# EAGLE design blockoccdelay (EAGLE 9.4.2)
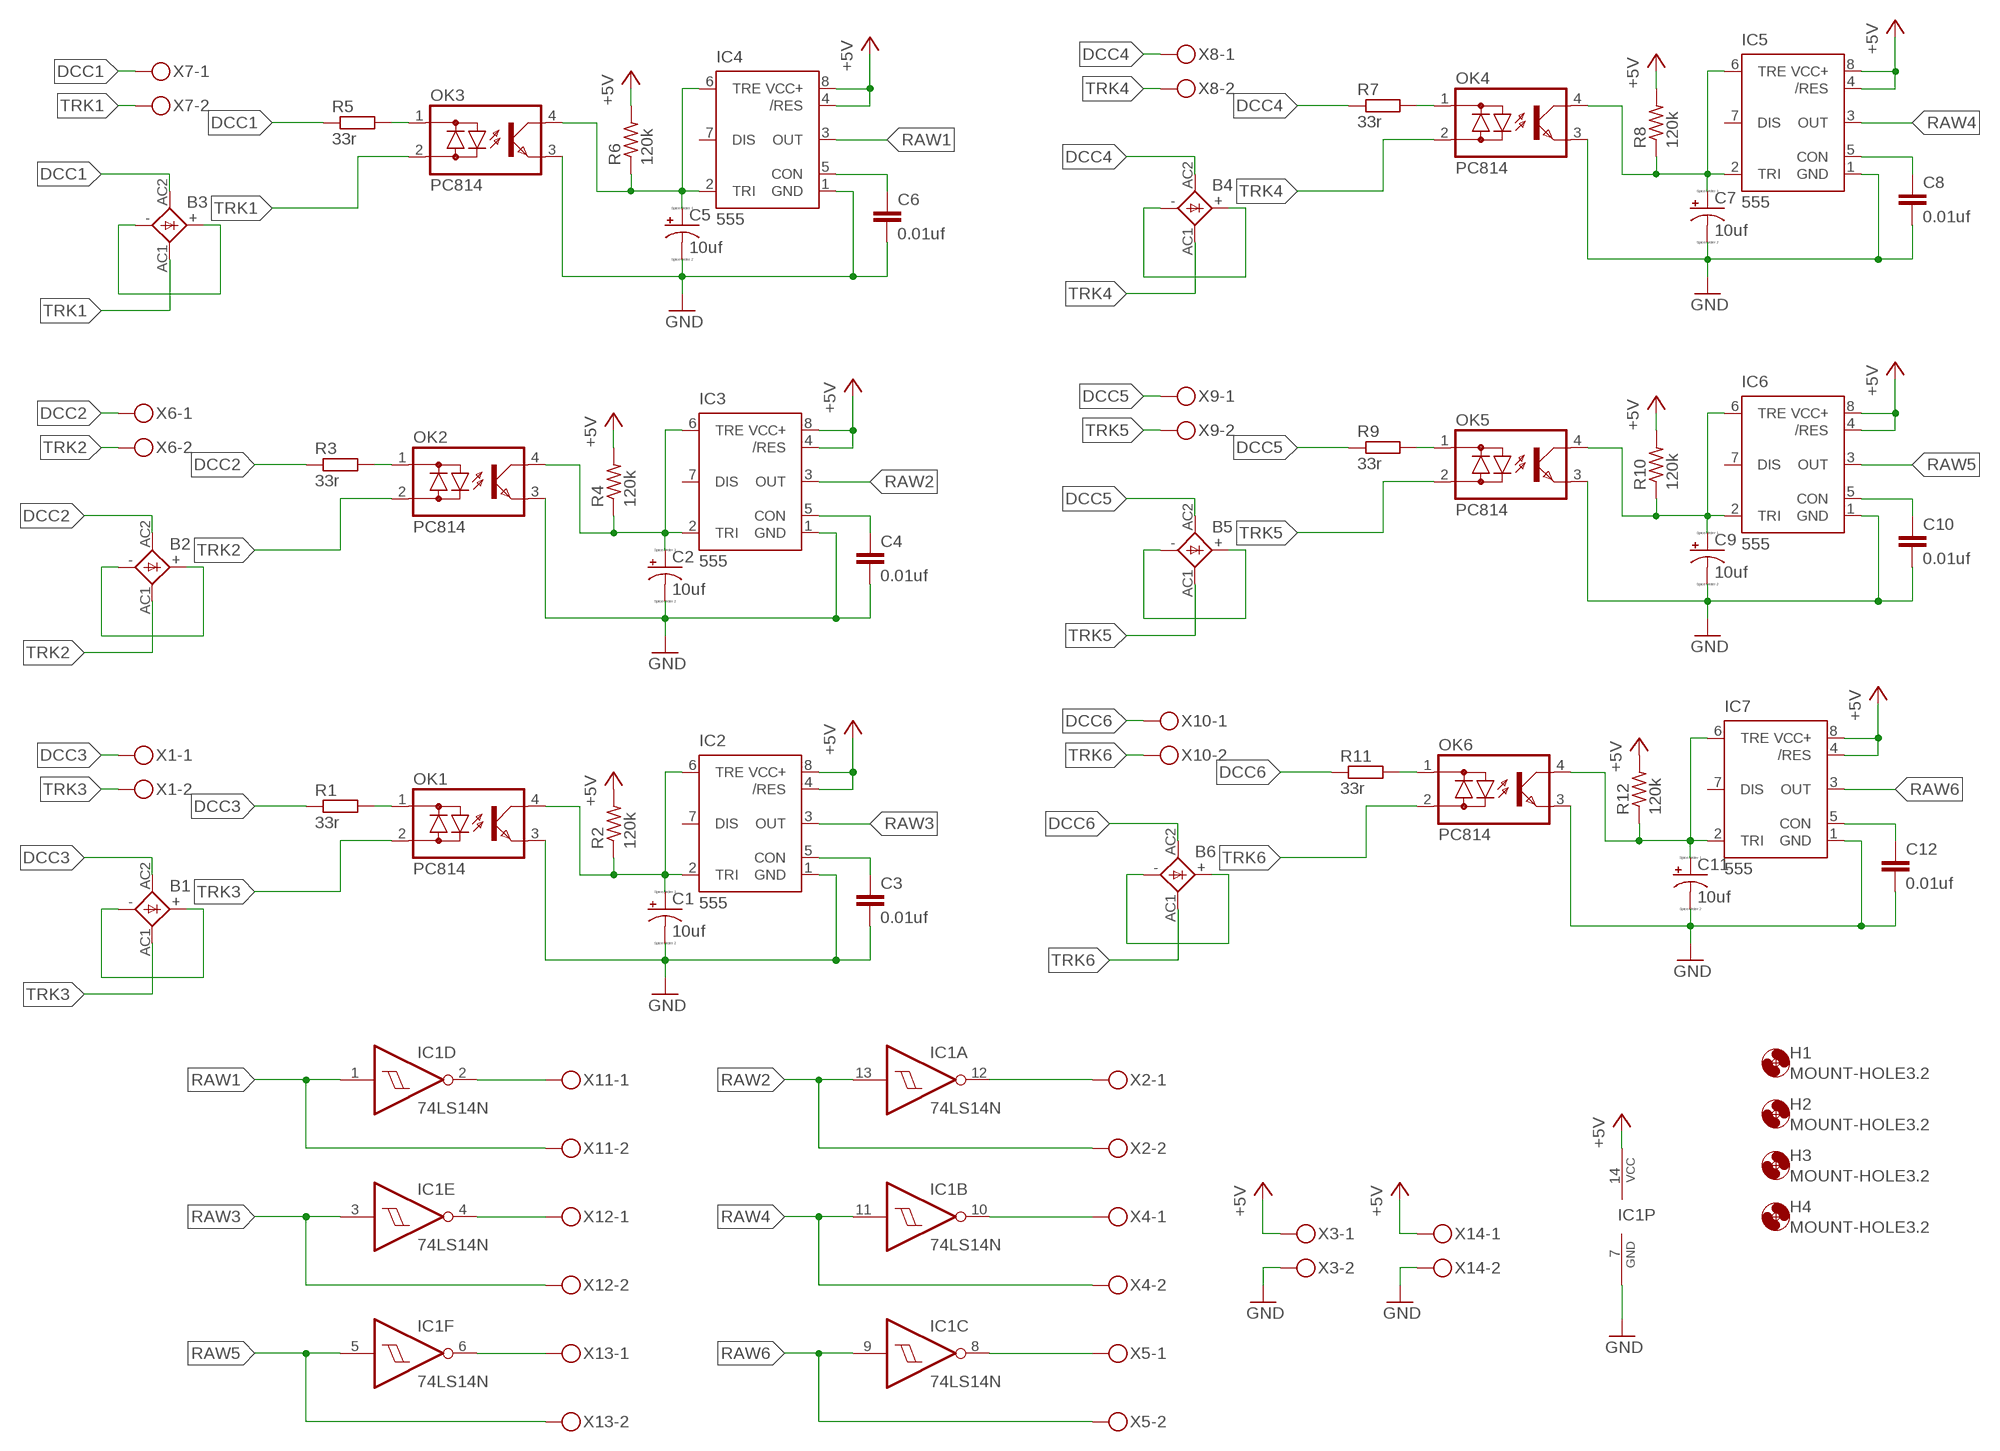
[diagram p0: schematic, sheet 1]

## Parts
B1  GBU4  [GBU4S]
B2  GBU4  [GBU4S]
B3  GBU4  [GBU4S]
B4  GBU4  [GBU4S]
B5  GBU4  [GBU4S]
B6  GBU4  [GBU4S]
C1  10uf  CPOL-USE2.5-6  [E2,5-6]
C2  10uf  CPOL-USE2.5-6  [E2,5-6]
C3  0.01uf  C-EU050-035X075  [C050-035X075]
C4  0.01uf  C-EU050-035X075  [C050-035X075]
C5  10uf  CPOL-USE2.5-6  [E2,5-6]
C6  0.01uf  C-EU050-035X075  [C050-035X075]
C7  10uf  CPOL-USE2.5-6  [E2,5-6]
C8  0.01uf  C-EU050-035X075  [C050-035X075]
C9  10uf  CPOL-USE2.5-6  [E2,5-6]
C10  0.01uf  C-EU050-035X075  [C050-035X075]
C11  10uf  CPOL-USE2.5-6  [E2,5-6]
C12  0.01uf  C-EU050-035X075  [C050-035X075]
H1  MOUNT-HOLE3.2  [3,2]
H2  MOUNT-HOLE3.2  [3,2]
H3  MOUNT-HOLE3.2  [3,2]
H4  MOUNT-HOLE3.2  [3,2]
IC1  74LS14N  [DIL14]
IC2  555  555P  [DIP08]
IC3  555  555P  [DIP08]
IC4  555  555P  [DIP08]
IC5  555  555P  [DIP08]
IC6  555  555P  [DIP08]
IC7  555  555P  [DIP08]
OK1  PC814  [DIL04]
OK2  PC814  [DIL04]
OK3  PC814  [DIL04]
OK4  PC814  [DIL04]
OK5  PC814  [DIL04]
OK6  PC814  [DIL04]
R1  33r  R-EU_0207/2V  [0207/2V]
R2  120k  R-US_0309/V  [0309V]
R3  33r  R-EU_0207/2V  [0207/2V]
R4  120k  R-US_0309/V  [0309V]
R5  33r  R-EU_0207/2V  [0207/2V]
R6  120k  R-US_0309/V  [0309V]
R7  33r  R-EU_0207/2V  [0207/2V]
R8  120k  R-US_0309/V  [0309V]
R9  33r  R-EU_0207/2V  [0207/2V]
R10  120k  R-US_0309/V  [0309V]
R11  33r  R-EU_0207/2V  [0207/2V]
R12  120k  R-US_0309/V  [0309V]
X1  MKDSN1,5/2-5,08  [MKDSN1,5/2-5,08]
X2  MKDSN1,5/2-5,08  [MKDSN1,5/2-5,08]
X3  MKDSN1,5/2-5,08  [MKDSN1,5/2-5,08]
X4  MKDSN1,5/2-5,08  [MKDSN1,5/2-5,08]
X5  MKDSN1,5/2-5,08  [MKDSN1,5/2-5,08]
X6  MKDSN1,5/2-5,08  [MKDSN1,5/2-5,08]
X7  MKDSN1,5/2-5,08  [MKDSN1,5/2-5,08]
X8  MKDSN1,5/2-5,08  [MKDSN1,5/2-5,08]
X9  MKDSN1,5/2-5,08  [MKDSN1,5/2-5,08]
X10  MKDSN1,5/2-5,08  [MKDSN1,5/2-5,08]
X11  MKDSN1,5/2-5,08  [MKDSN1,5/2-5,08]
X12  MKDSN1,5/2-5,08  [MKDSN1,5/2-5,08]
X13  MKDSN1,5/2-5,08  [MKDSN1,5/2-5,08]
X14  MKDSN1,5/2-5,08  [MKDSN1,5/2-5,08]

## Nets
+5V: IC1.14(P:VCC) IC2.4(/RES) IC2.8(VCC+) IC3.4(/RES) IC3.8(VCC+) IC4.4(/RES) IC4.8(VCC+) IC5.4(/RES) IC5.8(VCC+) IC6.4(/RES) IC6.8(VCC+) IC7.4(/RES) IC7.8(VCC+) R2.2 R4.2 R6.2 R8.2 R10.2 R12.2 X3.1 X14.1
DCC1: B3.AC2(AC1) R5.1 X7.1
DCC2: B2.AC2(AC1) R3.1 X6.1
DCC3: B1.AC2(AC1) R1.1 X1.1
DCC4: B4.AC2(AC1) R7.1 X8.1
DCC5: B5.AC2(AC1) R9.1 X9.1
DCC6: B6.AC2(AC1) R11.1 X10.1
GND: C1.- C2.- C3.2 C4.2 C5.- C6.2 C7.- C8.2 C9.- C10.2 C11.- C12.2 IC1.7(P:GND) IC2.1(GND) IC3.1(GND) IC4.1(GND) IC5.1(GND) IC6.1(GND) IC7.1(GND) OK1.3(E) OK2.3(E) OK3.3(E) OK4.3(E) OK5.3(E) OK6.3(E) X3.2 X14.2
N$1: B1.+ B1.-
N$2: OK1.1(AC1) R1.2
N$3: C3.1 IC2.5(CON)
N$4: IC1.12(A:O) X2.1
N$5: B4.+ B4.-
N$6: OK4.1(AC1) R7.2
N$7: IC1.10(B:O) X4.1
N$8: C8.1 IC5.5(CON)
N$9: IC1.8(C:O) X5.1
N$10: B2.+ B2.-
N$11: OK2.1(AC1) R3.2
N$12: C4.1 IC3.5(CON)
N$13: B3.+ B3.-
N$14: OK3.1(AC1) R5.2
N$15: C6.1 IC4.5(CON)
N$16: B5.+ B5.-
N$17: OK5.1(AC1) R9.2
N$18: C10.1 IC6.5(CON)
N$19: B6.+ B6.-
N$20: OK6.1(AC1) R11.2
N$21: C12.1 IC7.5(CON)
N$22: IC1.2(D:O) X11.1
N$23: IC1.4(E:O) X12.1
N$24: IC1.6(F:O) X13.1
RAW1: IC1.1(D:I) IC4.3(OUT) X11.2
RAW2: IC1.13(A:I) IC3.3(OUT) X2.2
RAW3: IC1.3(E:I) IC2.3(OUT) X12.2
RAW4: IC1.11(B:I) IC5.3(OUT) X4.2
RAW5: IC1.5(F:I) IC6.3(OUT) X13.2
RAW6: IC1.9(C:I) IC7.3(OUT) X5.2
TRI: C1.+ IC2.2(TRI) IC2.6(TRE) OK1.4(C) R2.1
TRI1: C2.+ IC3.2(TRI) IC3.6(TRE) OK2.4(C) R4.1
TRI2: C5.+ IC4.2(TRI) IC4.6(TRE) OK3.4(C) R6.1
TRI3: C7.+ IC5.2(TRI) IC5.6(TRE) OK4.4(C) R8.1
TRI4: C9.+ IC6.2(TRI) IC6.6(TRE) OK5.4(C) R10.1
TRI5: C11.+ IC7.2(TRI) IC7.6(TRE) OK6.4(C) R12.1
TRK1: B3.AC1(AC2) OK3.2(AC2) X7.2
TRK2: B2.AC1(AC2) OK2.2(AC2) X6.2
TRK3: B1.AC1(AC2) OK1.2(AC2) X1.2
TRK4: B4.AC1(AC2) OK4.2(AC2) X8.2
TRK5: B5.AC1(AC2) OK5.2(AC2) X9.2
TRK6: B6.AC1(AC2) OK6.2(AC2) X10.2
Unconnected: IC2.7(DIS) IC3.7(DIS) IC4.7(DIS) IC5.7(DIS) IC6.7(DIS) IC7.7(DIS)

## Library data of the parts
B1-B6 = rectifier:GBU4: GENERAL INSTRUMENT RECTIFIER
C1 C2 C5 C7 C9 C11 = resistor:CPOL-US: POLARIZED CAPACITOR, American symbol
C3 C4 C6 C8 C10 C12 = resistor:C-EU: CAPACITOR, European symbol
H1-H4 = holes:MOUNT-HOLE: MOUNTING HOLE with drill center marker
IC1 = 74xx-us:74*14: Hex schmitt trigger INVERTER
IC2-IC7 = SparkFun-IC-Special-Function:555: General purpose bipolar Timer Datasheet <http://www.sparkfun.com/datasheets/Components/General/ne555.pdf> SparkFun Products SparkFun SparkPunk Sequencer Kit <https://www.sparkfun.com/products/12707> (KIT-12707) Storefront Component: 555 Timer <https://www.sparkfun.com/products/9273> (COM-09273) Two parts valid for production: VFP: IC-11930 (M7555 PTH) VFP: IC-09173 (555 PTH) - Preferred; PROD_ID: IC-09173; PROD_ID_ALT: IC-09173
OK1-OK6 = optocoupler:PC814: SHARP OPTO COUPLER; OC_FARNELL: 9707662; OC_NEWARK: unknown
R1 R3 R5 R7 R9 R11 = resistor:R-EU_: RESISTOR, European symbol
R2 R4 R6 R8 R10 R12 = resistor:R-US_: RESISTOR, American symbol
X1-X14 = con-phoenix-508:MKDSN1,5/2-5,08: MKDSN 1,5/ 2-5,08 Printklemme Nennstrom: 13,5 A Nennspannung: 250 V Rastermaß: 5,08 mm Polzahl: 2 Anschlussart: Schraubanschluss Montage: Löten Anschlussrichtung Leiter/Platine: 0 ° Artikelnummer: 1729128 Source: http://eshop.phoenixcontact.com .. 1729128.pdf

## Board
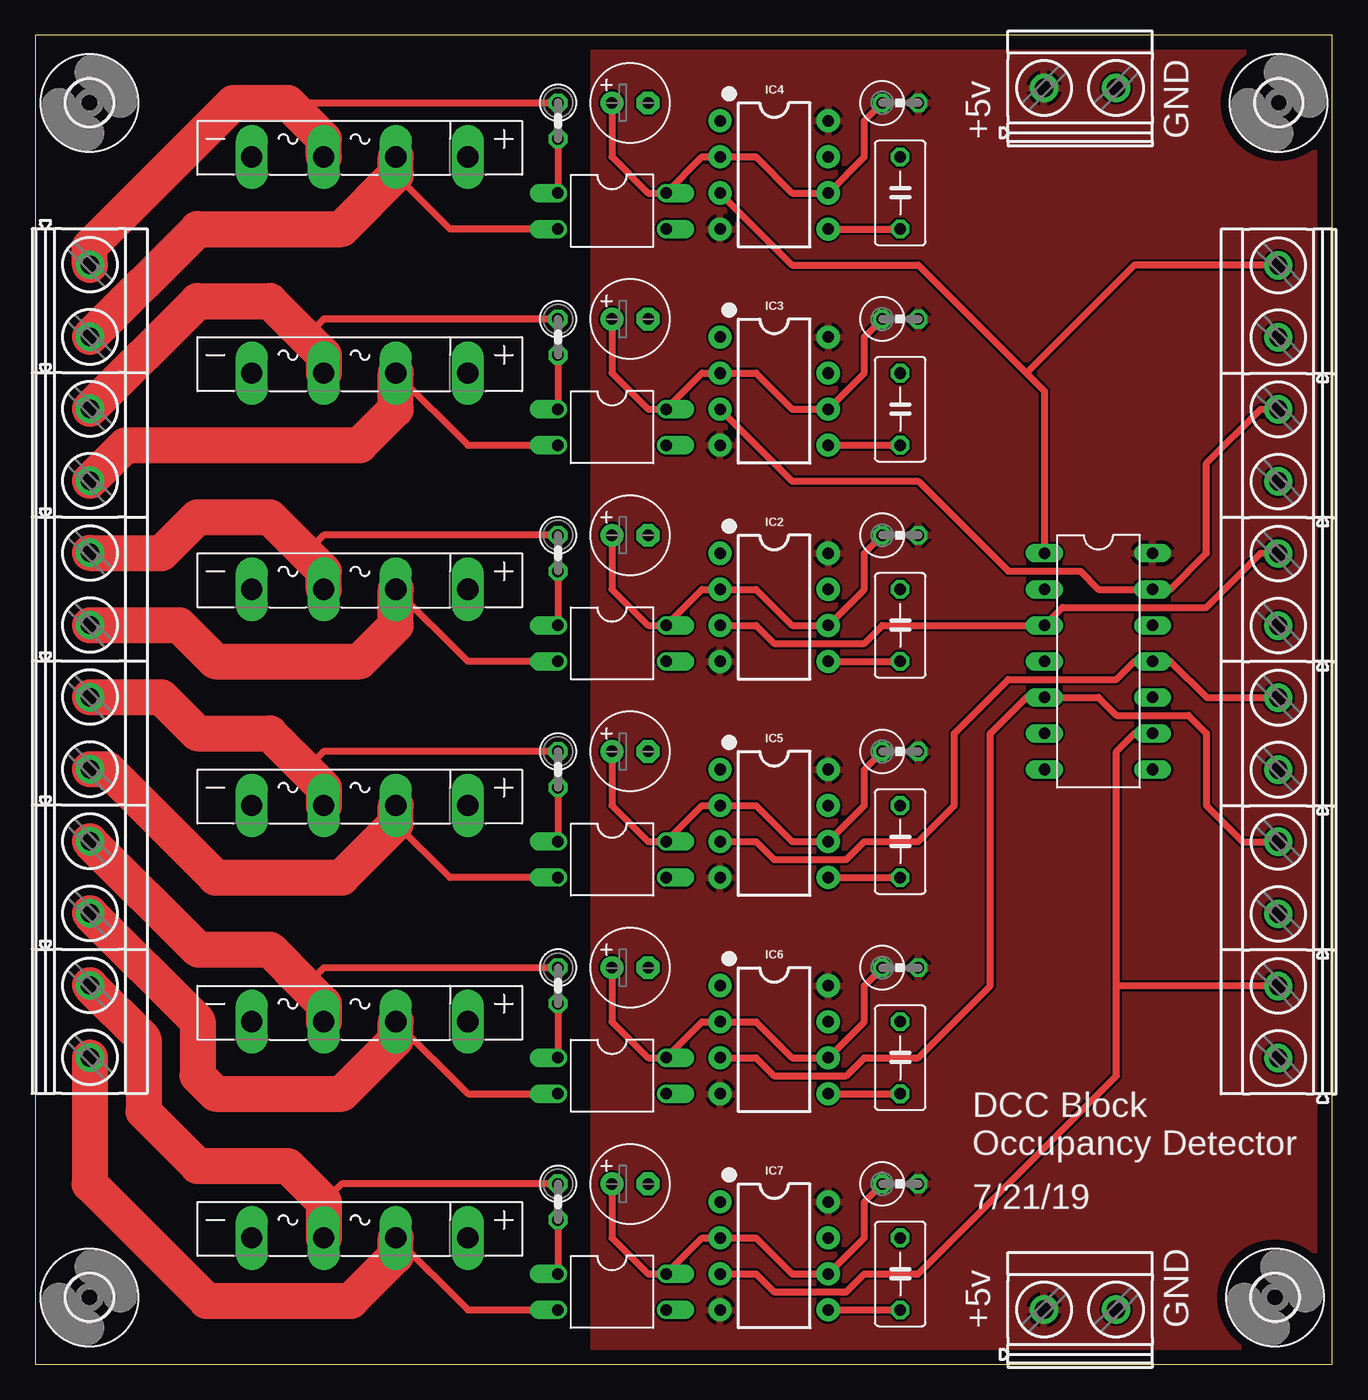
[diagram p1: board, top side]
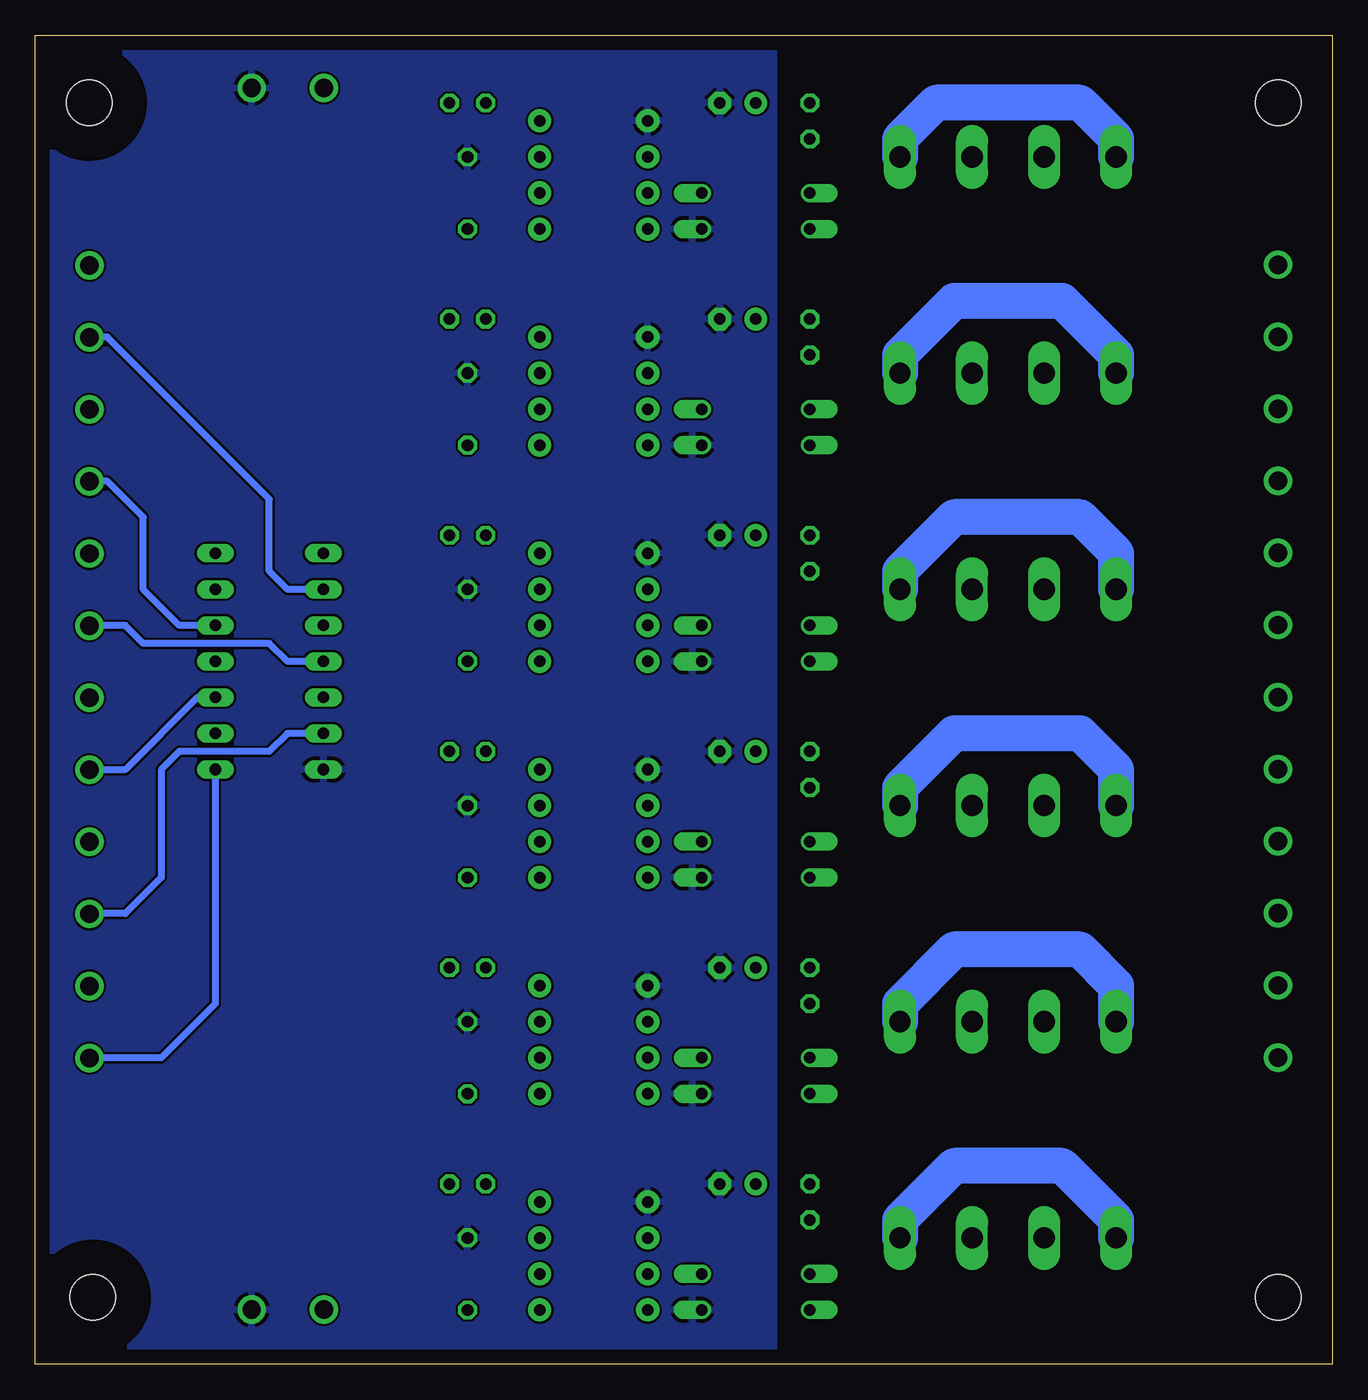
[diagram p2: board, bottom side, seen from below]

Size 91.42 x 93.65 mm. Coordinates in mm from the lower left corner, seen from the top.
Outline: 0,0 91.42,0 91.42,93.65 0,93.65 0,0
Copper layers (1*16): Top 0.035mm / dielectric 1.5mm / Bottom 0.035mm
Design rules "default": minimum track width 6mil, minimum drill 0.35mm, track to track 6mil, track to pad 6mil, pad to pad 6mil, via to via 6mil, smd to smd 6mil, copper to edge 40mil, drill to drill 6mil, minimum pad ring 10mil, minimum via ring 8mil, stop-mask expansion 4mil, vias tented up to drill 0mil, thermal gap 10mil

### Footprints (pad centres in the part's own frame; a part is rotated, then mirrored left to right if it is on the bottom)
GBU4S = drill 1.499 long: + 7.62,0; - -7.62,0; AC1 2.54,0; AC2 -2.54,0
E2,5-6 = drill 0.813 pad 1.6: + -1.27,0 | drill 0.813 pad 1.6 octagon: - 1.27,0
C050-035X075 = drill 0.813 octagon: 1 -2.54,0; 2 2.54,0
3,2 = hole 3.2: 0,0
DIL14 = drill 0.813 long: 1 -7.62,-3.81; 2 -5.08,-3.81; 3 -2.54,-3.81; 4 0,-3.81; 5 2.54,-3.81; 6 5.08,-3.81; 7 7.62,-3.81; 8 7.62,3.81; 9 5.08,3.81; 10 2.54,3.81; 11 0,3.81; 12 -2.54,3.81; 13 -5.08,3.81; 14 -7.62,3.81
DIP08 = drill 0.813 pad 1.626: 1 -3.81,-3.81; 2 -1.27,-3.81; 3 1.27,-3.81; 4 3.81,-3.81; 5 3.81,3.81; 6 1.27,3.81; 7 -1.27,3.81; 8 -3.81,3.81
DIL04 = drill 0.813 offset: 1 -1.27,-3.81; 2 1.27,-3.81; 3 1.27,3.81; 4 -1.27,3.81
0207/2V = drill 0.813 octagon: 1 -1.27,0; 2 1.27,0
0309V = drill 0.813 octagon: 1 -1.27,0; 2 1.27,0
MKDSN1,5/2-5,08 = drill 1.3 pad 2: 1 -2.561,0.025; 2 2.519,0.025

### Placement (x,y rotation side)
B1  22.86,54.61 0 top
B2  22.86,69.85 0 top
B3  22.86,85.09 0 top
B4  22.86,39.37 0 top
B5  22.86,24.13 0 top
B6  22.86,8.89 0 top
C1  41.91,58.42 0 top
C2  41.91,73.66 0 top
C3  60.96,52.07 90 top
C4  60.96,67.31 90 top
C5  41.91,88.9 0 top
C6  60.96,82.55 90 top
C7  41.91,43.18 0 top
C8  60.96,36.83 90 top
C9  41.91,27.94 0 top
C10  60.96,21.59 90 top
C11  41.91,12.7 0 top
C12  60.96,6.35 90 top
H1  3.81,4.7 0 top
H2  87.38,4.7 0 top
H3  87.63,88.9 0 top
H4  3.81,88.9 0 top
IC1  74.93,49.53 270 top
IC2  52.07,53.34 270 top
IC3  52.07,68.58 270 top
IC4  52.07,83.82 270 top
IC5  52.07,38.1 270 top
IC6  52.07,22.86 270 top
IC7  52.07,7.62 270 top
OK1  40.64,50.8 270 top
OK2  40.64,66.04 270 top
OK3  40.64,81.28 270 top
OK4  40.64,35.56 270 top
OK5  40.64,20.32 270 top
OK6  40.64,5.08 270 top
R1  36.83,57.15 270 top
R2  60.96,58.42 0 top
R3  36.83,72.39 270 top
R4  60.96,73.66 0 top
R5  36.83,87.63 270 top
R6  60.96,88.9 0 top
R7  36.83,41.91 270 top
R8  60.96,43.18 0 top
R9  36.83,26.67 270 top
R10  60.96,27.94 0 top
R11  36.83,11.43 270 top
R12  60.96,12.7 0 top
X1  3.81,54.61 270 top
X2  87.63,64.77 90 top
X3  73.66,3.81 0 top
X4  87.63,44.45 90 top
X5  87.63,24.13 90 top
X6  3.81,64.77 270 top
X7  3.81,74.93 270 top
X8  3.81,44.45 270 top
X9  3.81,34.29 270 top
X10  3.81,24.13 270 top
X11  87.63,74.93 90 top
X12  87.63,54.61 90 top
X13  87.63,34.29 90 top
X14  73.66,89.92 0 top

### Tracks (layer width: path | path; a pad name or v marks a point on that pad's centre or on a via)
+5V
  pour Top: 39.37,-2.54 39.37,99.06 109.22,99.06 109.22,-2.54
DCC1
  Top 0.508: 17.78,88.9 R5.1
  Top 2.54: B3.AC2 20.32,86.36 17.78,88.9 13.97,88.9 3.83,78.77 X7.1
DCC2
  Top 0.508: R3.1 20.32,73.66 19.05,72.39
  Top 2.54: X6.1 11.43,74.93 16.51,74.93 19.05,72.39 20.32,71.12 B2.AC2
DCC3
  Top 0.508: R1.1 20.32,58.42 19.05,57.15
  Top 2.54: B1.AC2 20.32,55.88 19.05,57.15 16.51,59.69 11.43,59.69 8.89,57.15 8.87,57.17 X1.1
DCC4
  Top 0.508: R7.1 20.32,43.18 19.05,41.91
  Top 2.54: X8.1 8.87,47.01 11.43,44.45 16.51,44.45 19.05,41.91 20.32,40.64 B4.AC2
DCC5
  Top 0.508: R9.1 20.32,27.94 19.05,26.67
  Top 2.54: X9.1 11.48,29.21 16.51,29.21 19.05,26.67 20.32,25.4 B5.AC2
DCC6
  Top 0.508: R11.1 21.59,12.7 20.32,11.43
  Top 2.54: X10.1 7.62,22.91 7.62,17.78 11.43,13.97 17.78,13.97 20.32,11.43 B6.AC2
GND
  pour Bottom: 39.37,-3.81 39.37,100.33 107.95,100.33 107.95,-3.81
N$1
  Bottom 2.54: B1.- 15.24,57.15 17.78,59.69 26.67,59.69 30.48,55.88 B1.+
N$2
  Top 0.508: R1.2 OK1.1
N$3
  Top 0.508: IC2.5 C3.1
N$4
  Bottom 0.508: IC1.12 81.28,52.07 83.82,54.61 83.82,59.69 86.36,62.23 87.58,62.23 X2.1
N$5
  Bottom 2.54: B4.- 15.24,41.91 17.78,44.45 26.67,44.45 30.48,40.64 B4.+
N$6
  Top 0.508: R7.2 OK4.1
N$7
  Bottom 0.508: IC1.10 80.01,46.99 85.11,41.89 X4.1
N$8
  Top 0.508: IC5.5 C8.1
N$9
  Bottom 0.508: IC1.8 78.74,25.4 82.55,21.59 87.58,21.59 X5.1
N$10
  Bottom 2.54: B2.- 15.24,71.12 19.05,74.93 26.67,74.93 30.48,71.12 B2.+
N$11
  Top 0.508: R3.2 OK2.1
N$12
  Top 0.508: IC3.5 C4.1
N$13
  Bottom 2.54: B3.- 15.24,86.36 17.78,88.9 27.94,88.9 30.48,86.36 B3.+
N$14
  Top 0.508: R5.2 OK3.1
N$15
  Top 0.508: IC4.5 C6.1
N$16
  Bottom 2.54: B5.- 15.24,26.67 17.78,29.21 26.67,29.21 30.48,25.4 B5.+
N$17
  Top 0.508: R9.2 OK5.1
N$18
  Top 0.508: IC6.5 C10.1
N$19
  Bottom 2.54: B6.- 15.24,10.16 19.05,13.97 26.67,13.97 30.48,10.16 B6.+
N$20
  Top 0.508: R11.2 OK6.1
N$21
  Top 0.508: IC7.5 C12.1
N$22
  Bottom 0.508: IC1.2 73.66,54.61 74.93,55.88 74.93,60.96 86.36,72.39 87.58,72.39 X11.1
N$23
  Bottom 0.508: IC1.4 73.66,49.53 74.93,50.8 83.82,50.8 85.09,52.07 87.58,52.07 X12.1
N$24
  Bottom 0.508: IC1.6 73.66,44.45 74.93,43.18 81.28,43.18 82.55,41.91 82.55,34.29 85.09,31.75 87.58,31.75 X13.1
RAW1
  Top 0.508: IC4.3 53.34,77.47 62.23,77.47 69.85,69.85 | 69.85,69.85 71.12,68.58 IC1.1 | X11.2 77.45,77.45 69.85,69.85
RAW2
  Top 0.508: IC3.3 53.34,62.23 62.23,62.23 68.58,55.88 73.66,55.88 74.93,54.61 IC1.13 80.01,54.61 82.55,57.15 82.55,63.5 86.36,67.31 87.58,67.31 X2.2
RAW3
  Top 0.508: IC2.3 50.8,52.07 52.07,50.8 58.42,50.8 59.69,52.07 IC1.3 72.39,53.34 82.55,53.34 86.36,57.15 87.58,57.15 X12.2
RAW4
  Top 0.508: IC5.3 50.8,36.83 52.07,35.56 57.15,35.56 58.42,36.83 62.23,36.83 64.77,39.37 64.77,44.45 68.58,48.26 76.2,48.26 77.47,49.53 IC1.11 80.01,49.53 82.57,46.97 X4.2
RAW5
  Top 0.508: IC6.3 50.8,21.59 52.07,20.32 57.15,20.32 58.42,21.59 62.23,21.59 67.31,26.67 67.31,44.45 69.85,46.99 IC1.5 74.93,46.99 76.2,45.72 81.28,45.72 82.55,44.45 82.55,39.37 85.11,36.81 X13.2
RAW6
  Top 0.508: IC7.3 50.8,6.35 52.07,5.08 57.15,5.08 58.42,6.35 62.23,6.35 76.2,20.32 76.2,26.67 | 76.2,26.67 76.2,43.18 77.47,44.45 IC1.9 | X5.2 76.22,26.65 76.2,26.67
TRI
  Top 0.508: C1.+ 40.64,54.61 43.18,52.07 OK1.4 46.99,54.61 IC2.2 50.8,54.61 53.34,52.07 IC2.6 58.42,54.61 58.42,57.15 R2.1
TRI1
  Top 0.508: C2.+ 40.64,69.85 43.18,67.31 OK2.4 46.99,69.85 IC3.2 50.8,69.85 53.34,67.31 IC3.6 58.42,69.85 58.42,72.39 R4.1
TRI2
  Top 0.508: C5.+ 40.64,85.09 43.18,82.55 OK3.4 46.99,85.09 IC4.2 50.8,85.09 53.34,82.55 IC4.6 58.42,85.09 58.42,87.63 R6.1
TRI3
  Top 0.508: C7.+ 40.64,39.37 43.18,36.83 OK4.4 46.99,39.37 IC5.2 50.8,39.37 53.34,36.83 IC5.6 58.42,39.37 58.42,41.91 R8.1
TRI4
  Top 0.508: C9.+ 40.64,24.13 43.18,21.59 OK5.4 46.99,24.13 IC6.2 50.8,24.13 53.34,21.59 IC6.6 58.42,24.13 58.42,26.67 R10.1
TRI5
  Top 0.508: C11.+ 40.64,8.89 43.18,6.35 OK6.4 46.99,8.89 IC7.2 50.8,8.89 53.34,6.35 IC7.6 58.42,8.89 58.42,11.43 R12.1
TRK1
  Top 0.508: 25.4,83.82 29.21,80.01 OK3.2
  Top 2.54: X7.2 11.43,80.01 21.59,80.01 25.4,83.82 B3.AC1
TRK2
  Top 0.508: B2.AC1 30.48,64.77 OK2.2
  Top 2.54: X6.2 6.35,64.77 22.86,64.77 25.4,67.31 B2.AC1
TRK3
  Top 0.508: OK1.2 30.48,49.53 B1.AC1
  Top 2.54: X1.2 10.14,52.09 12.7,49.53 22.86,49.53 25.4,52.07 B1.AC1
TRK4
  Top 0.508: OK4.2 29.21,34.29 25.4,38.1
  Top 2.54: X8.2 5.06,41.93 12.7,34.29 21.59,34.29 25.4,38.1 B4.AC1
TRK5
  Top 0.508: B5.AC1 30.48,19.05 OK5.2
  Top 2.54: B5.AC1 25.4,22.86 21.59,19.05 12.7,19.05 11.43,20.32 11.43,24.18 X9.2
TRK6
  Top 0.508: B6.AC1 30.48,3.81 OK6.2
  Top 2.54: X10.2 3.83,12.72 3.81,12.7 12.06,4.45 22.23,4.45 25.4,7.62 B6.AC1

### Text on the board
tNames: +5v | GND | DCC Block / Occupancy Detector | 7/21/19 | +5v | GND